# Altium project PCB_Project_5.PrjPcb
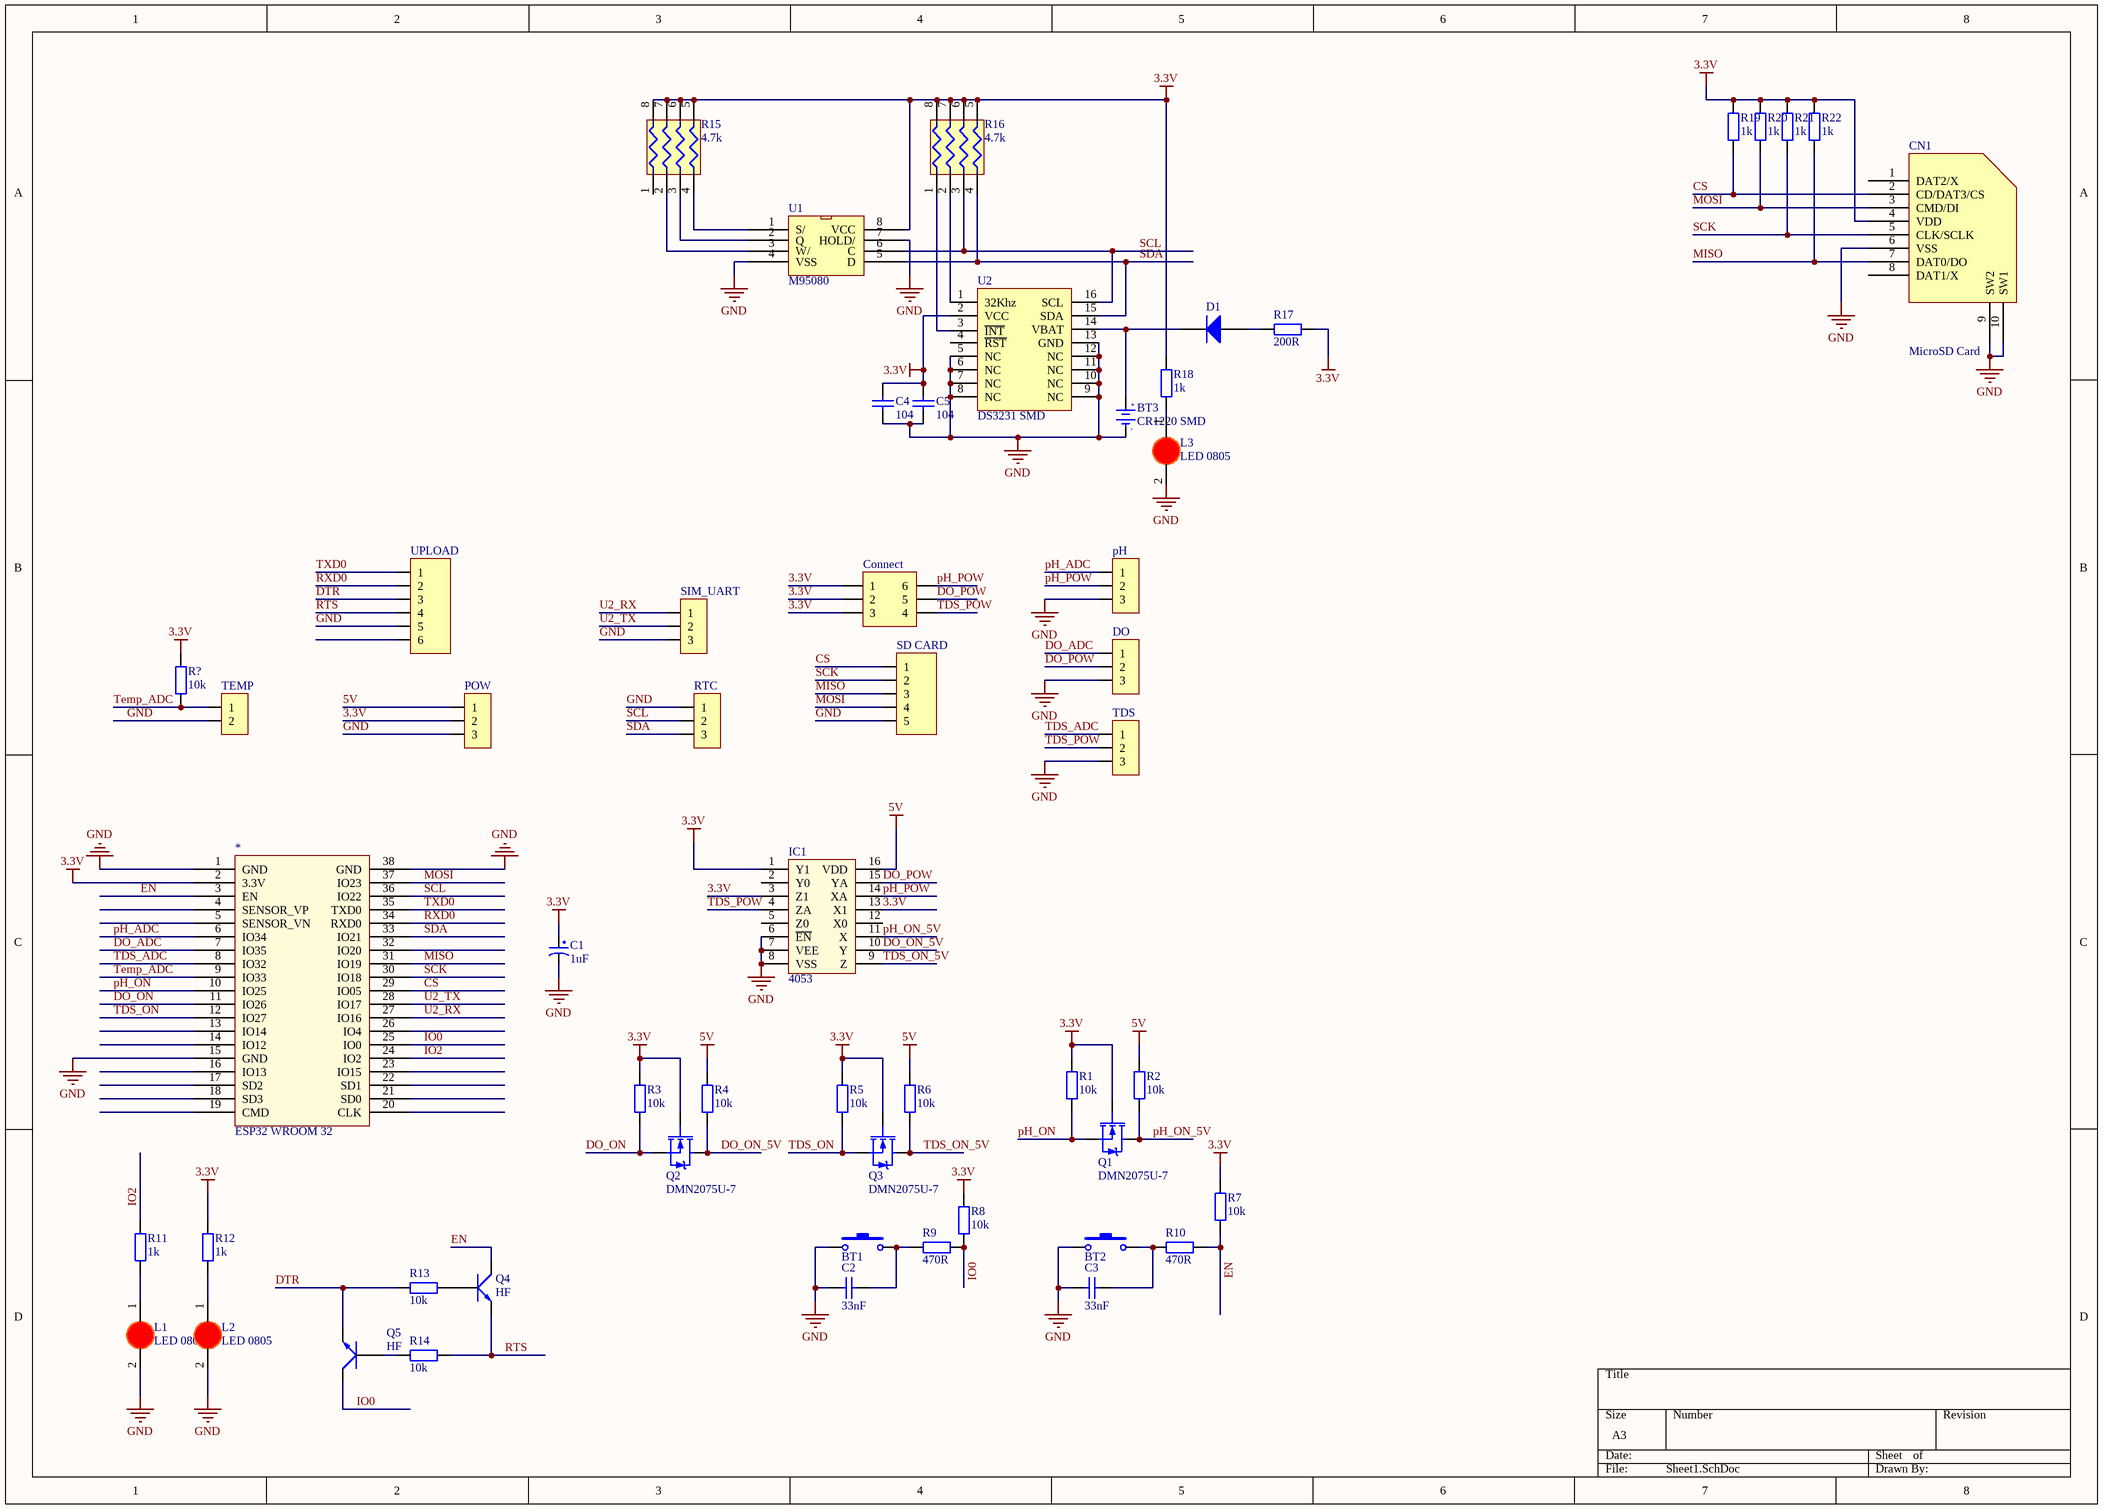
[diagram p0: Sheet1.SchDoc]
1 sheet, 55 parts. Net scope: global (net labels, ports and power ports of the same name join across sheets).
Board file: PCB1.PcbDoc

## Sheet Sheet1.SchDoc
size A3

### Parts
*  ESP32 WROOM 32  [ESP32-WROOM-32D]
BT1  Nut Nhan 2 Chan SMD 3x6x2.5  [Nut Nhan 2 Chan SMD 3x6x2.5]  (value not drawn)
BT2  Nut Nhan 2 Chan SMD 3x6x2.5  [Nut Nhan 2 Chan SMD 3x6x2.5]  (value not drawn)
BT3  CR1220 SMD  [DE PIN CR1220]
C1  1uF  [tu tantalum smd3216]
C2  33nF  [tu 0805]
C3  33nF  [tu 0805]
C4  104  [tu 0805]
C5  104  [tu 0805]
CN1  MicroSD Card  [MicroSD Card]
Connect  JP 2x3 2.54  [JP 2x3 DT]  (value not drawn)
D1  Diode  [SOD80]  (value not drawn)
DO  DO  [JP 1x3 DT]  (value not drawn)
IC1  4053  [SO16]
L1  LED 0805  [LED-0805-Red]
L2  LED 0805  [LED-0805-Red]
L3  LED 0805  [LED-0805-Red]
pH  pH  [JP 1x3 DT]  (value not drawn)
POW  JP 1x3 2.54  [JP 1x3 DT]  (value not drawn)
Q1  DMN2075U-7  [SOT23]
Q2  DMN2075U-7  [SOT23]
Q3  DMN2075U-7  [SOT23]
Q4  HF  [SOT23]
Q5  HF  [SOT23]
R1  10k  [tro smd 0805]
R2  10k  [tro smd 0805]
R3  10k  [tro smd 0805]
R4  10k  [tro smd 0805]
R5  10k  [tro smd 0805]
R6  10k  [tro smd 0805]
R7  10k  [tro smd 0805]
R8  10k  [tro smd 0805]
R9  470R  [Tro SMD 0805]
R10  470R  [Tro SMD 0805]
R11  1k  [tro smd 0805]
R12  1k  [tro smd 0805]
R13  10k  [tro smd 0805]
R14  10k  [tro smd 0805]
R15  4.7k  [tro bang 0603 4]
R16  4.7k  [tro bang 0603 4]
R17  200R  [tro smd 0805]
R18  1k  [tro smd 0805]
R19  1k  [tro smd 0805]
R20  1k  [tro smd 0805]
R21  1k  [tro smd 0805]
R22  1k  [tro smd 0805]
R23  10k  [tro smd 0805]
RTC  JP 1x3 2.54  [JP 1x3 DT]  (value not drawn)
SD_CARD  JP 1x5 2.54  [JP 1x5 DT]  (value not drawn)
SIM_UART  SIM_UART  [JP 1x3 DT]  (value not drawn)
TDS  TDS  [JP 1x3 DT]  (value not drawn)
TEMP  JP 1x2 2.54  [JP 1x2 DT]  (value not drawn)
U1  M95080  [SOP8_L]
U2  DS3231 SMD  [SOIC 16]
UPLOAD  JP 1x6 2.54  [JP 1x6 DT]  (value not drawn)

### Nets
3.3V: *.2(3.3V) C1.1 C4.1 C5.1 CN1.4(VDD) Connect.1 Connect.2 Connect.3 IC1.1(Y1) IC1.3(Z1) IC1.13(X1) POW.2 Q1.1(G) Q2.1(G) Q3.1(G) R1.2 R3.2 R5.2 R7.2 R8.2 R12.1 R15.5 R15.6 R15.7 R15.8 R16.5 R16.6 R16.7 R16.8 R17.1 R18.2 R19.2 R20.2 R21.2 R22.2 R23.2 U1.8(VCC) U2.2(VCC)
5V: IC1.16(VDD) POW.1 R2.2 R4.2 R6.2
GND: *.1(GND) *.15(GND) *.38(GND) BT1.1 BT2.1 BT3.2(GND) C1.2 C2.2 C3.2 C4.2 C5.2 CN1.6(VSS) CN1.9(SW2) CN1.10(SW1) DO.3 IC1.6(~{EN}) IC1.7(VEE) IC1.8(VSS) L1.2(K) L2.2(K) L3.2(K) pH.3 POW.3 RTC.1 SD_CARD.5 SIM_UART.3 TDS.3 TEMP.2 U1.4(VSS) U1.7(HOLD/) U2.5(NC) U2.6(NC) U2.7(NC) U2.8(NC) U2.9(NC) U2.10(NC) U2.11(NC) U2.12(NC) U2.13(GND) UPLOAD.5
CS: *.29(IO05) CN1.2(CD/DAT3/CS) R19.1 SD_CARD.1
DO_ADC: *.7(IO35) DO.1
DO_ON: *.11(IO26) Q2.2(S) R3.1
DO_ON_5V: IC1.10(Y) Q2.3(D) R4.1
DO_POW: Connect.5 DO.2 IC1.15(YA)
DTR: Q5.2(E) R13.1 UPLOAD.3
EN: *.3(EN) Q4.3(C) R7.1 R10.2
IO0: *.25(IO0) Q5.3(C) R8.1 R9.2
IO2: *.24(IO2) R11.1
MISO: *.31(IO19) CN1.7(DAT0/DO) R22.1 SD_CARD.3
MOSI: *.37(IO23) CN1.3(CMD/DI) R20.1 SD_CARD.4
pH_ADC: *.6(IO34) pH.1
pH_ON: *.10(IO25) Q1.2(S) R1.1
pH_ON_5V: IC1.11(X) Q1.3(D) R2.1
pH_POW: Connect.6 IC1.14(XA) pH.2
RTS: Q4.2(E) R14.2 UPLOAD.4
RXD0: *.34(RXD0) UPLOAD.2
SCK: *.30(IO18) CN1.5(CLK/SCLK) R21.1 SD_CARD.2
SCL: *.36(IO22) R16.3 RTC.2 U1.6(C) U2.16(SCL)
SDA: *.33(IO21) R16.4 RTC.3 U1.5(D) U2.15(SDA)
TDS_ADC: *.8(IO32) TDS.1
TDS_ON: *.12(IO27) Q3.2(S) R5.1
TDS_ON_5V: IC1.9(Z) Q3.3(D) R6.1
TDS_POW: Connect.4 IC1.4(ZA) TDS.2
Temp_ADC: *.9(IO33) R23.1 TEMP.1
TXD0: *.35(TXD0) UPLOAD.1
U2_RX: *.27(IO16) SIM_UART.1
U2_TX: *.28(IO17) SIM_UART.2
NetBT1_2: BT1.2 C2.1 R9.1
NetBT2_2: BT2.2 C3.1 R10.1
NetBT3_1: BT3.1(+3V) D1.2(K) U2.14(VBAT)
NetD1_1: D1.1(A) R17.2
NetL1_1: L1.1(A) R11.2
NetL2_1: L2.1(A) R12.2
NetL3_1: L3.1(A) R18.1
NetQ4_1: Q4.1(B) R13.2
NetQ5_1: Q5.1(B) R14.1
NetR15_2: R15.2 U1.3(W/)
NetR15_3: R15.3 U1.2(Q)
NetR15_4: R15.4 U1.1(S/)
NetR16_1: R16.1 U2.3(~{INT})
NetR16_2: R16.2 U2.1(32Khz)

Not connected (* = marked no-connect by the designer): * 4(SENSOR_VP) 5(SENSOR_VN) 13(IO14) 14(IO12) 16(IO13) 17(SD2) 18(SD3) 19(CMD) 20(CLK) 21(SD0) 22(SD1) 23(IO15) 26(IO4) 32(IO20); CN1 1(DAT2/X) 8(DAT1/X); IC1 2(Y0) 5(Z0) 12(X0); R15 1; U2 4(~{RST}); UPLOAD 6

### Notes on the sheet
- (in symbol De pin CR1220 SMD) +; -

### Library data of the parts
BT1 BT2 = Nut Nhan 2 Chan SMD 3x6x2.5: Ma_Hang: MH001036; Ten: Nút Nhấn 2 Chân 3x6x2.5MM SMD
BT3 = De pin CR1220 SMD: Ten: Đế PIN CR1220 SMD; Ma_Hang: MH000833
C1 = Tu tantalum 1uF 25V SMD3216: Dán; Don_Vi: Con; So_Chan: 2; Ten_Linh_Kien: Tụ tantalum 105E-1uF 25V SMD3216; Ma_Hang: MH007472; Chung_Loai: Dán; Kieu_Chan: *
C2 C3 = Tu 0805 33nF 50V 20%: Dán; Don_Vi: Con; So_Chan: 2; Ten_Linh_Kien: Tụ 0805 33nF 50V 20%; Ma_Hang: MH007854; Kieu_Chan: *; Chung_Loai: Dán
C4 C5 = Tu 0805 104 50V 10%: Dán; Don_Vi: Con; So_Chan: 2; Ten_Linh_Kien: Tụ 0805 104-100nF 10% 50V; Ma_Hang: MH004551; Chung_Loai: Dán; Kieu_Chan: *
Connect = JP 2x3 2.54 Duc Thang: Cắm; Ten_Linh_Kien: Jump Đôi Đực 2.54MM 2x40P Thẳng 11MM; Don_Vi: Con; Ma_Hang: MH002686; Ghi_Chu: *; Kieu_Chan: *; Chung_Loai: Cắm
D1 = Diode: Default Diode; Published: 8-Jun-2000; LatestRevisionDate: 17-Jul-2002; LatestRevisionNote: Re-released for DXP Platform.; PackageVersion: Sep-1996; PackageReference: SMC; Publisher: Altium Limited; Code_JEDEC: DO-214-AB
DO pH POW RTC SIM_UART TDS = JP 1x3 2.54 Duc Thang: Cắm; Ten_Linh_Kien: Jump Đơn Đực 2.54MM 1x40P Thẳng 11MM; Don_Vi: Con; Ma_Hang: MH000903; Ghi_Chu: *; Kieu_Chan: *; Chung_Loai: Cắm
IC1 = 4053: Dual 4-channel analogue  multiplexer/demultiplexer; Value: CD4053; Value: DIP16
L1-L3 = LED 0805 Do: Dán; Don_Vi: Con; Ma_Hang: MH000897; Ten_Linh_Kien: LED 0805 Màu Đỏ (Red); Ghi_Chu: *; Kieu_Chan: *; Chung_Loai: Dán
Q1-Q3 = DMN2075U-7: MOSFET N-CH 20V 4.2A SOT23; Published: 8-Jun-2000; LatestRevisionDate: 17-Jul-2002; LatestRevisionNote: Re-released for DXP Platform.; PackageVersion: 1995/1996; PackageReference: E3; Publisher: Altium Limited
Q4 Q5 = C1815 HF SMD: NPN transistor; Value: C9014
R1-R8 R11-R14 R18-R22 = Tro 0805 1% 1k: Dán; Don_Vi: Con; So_Chan: 2; Ten_Linh_Kien: Trở 0805 1% 1k; Ma_Hang: MH005468; Chung_Loai: Dán; Kieu_Chan: *
R9 R10 = Tro 0805 5% 470R: Dán; Don_Vi: Con; Ma_Hang: MH005341; Ten_Linh_Kien: Trở 0805 5% 470R; So_Chan: 2; Chung_Loai: Dán; Kieu_Chan: *
R15 R16 = Tro bang 0603 4.7k: Dán; Don_Vi: Con; So_Chan: 8; Ten_Linh_Kien: Trở băng 0603x4 4.7k; Ma_Hang: MH001448; Chung_Loai: Dán; Kieu_Chan: *
R17 = Tro 0805 5% 220R: Dán; Don_Vi: Con; So_Chan: 2; Ten_Linh_Kien: Trở 0805 5% 220R; Ma_Hang: MH005259; Chung_Loai: Dán; Kieu_Chan: *
R23 = Tro 0805 1% 10k: Dán; Don_Vi: Con; So_Chan: 2; Ten_Linh_Kien: Trở 0805 1% 10k; Ma_Hang: MH005473; Chung_Loai: Dán; Kieu_Chan: *
SD_CARD = JP 1x5 2.54 Duc Thang: Cắm; Ten_Linh_Kien: Jump Đơn Đực 2.54MM 1x40P Thẳng 11MM; Don_Vi: Con; Ma_Hang: MH000903; Ghi_Chu: *; Kieu_Chan: *; Chung_Loai: Cắm
TEMP = JP 1x2 2.54 Duc Thang: Cắm; Ten_Linh_Kien: Jump Đơn Đực 2.54MM 1x40P Thẳng 11MM; Don_Vi: Con; Ma_Hang: MH000903; Ghi_Chu: *; Kieu_Chan: *; Chung_Loai: Cắm
U1 = EEPROM_M95080
U2 = DS3231 SMD: SOIC
UPLOAD = JP 1x6 2.54 Duc Thang: Cắm; Ten_Linh_Kien: Jump Đơn Đực 2.54MM 1x40P Thẳng 11MM; Don_Vi: Con; Ma_Hang: MH000903; Ghi_Chu: *; Kieu_Chan: *; Chung_Loai: Cắm